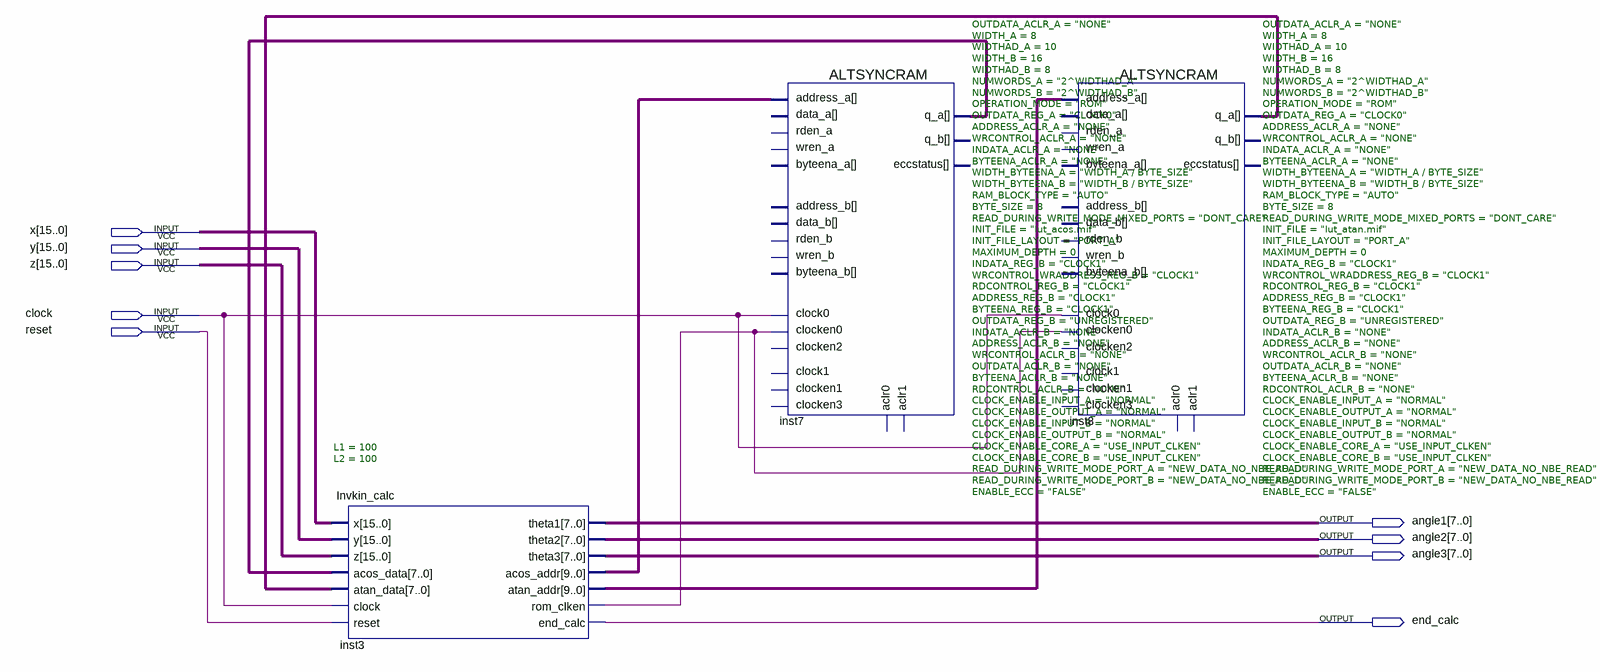
[diagram p0: schematic sheet]
// Quartus schematic invkin_geo.bdf as structural Verilog: 3 symbols, 9 pins
module invkin_geo (
  input  [15:0] x,
  input  [15:0] y,
  input  [15:0] z,
  input  clock,
  input  reset,
  output [7:0] angle1,
  output [7:0] angle2,
  output [7:0] angle3,
  output end_calc
);

  wire inst3_rom_clken;
  wire [7:0] inst7_q_a, inst8_q_a;
  wire [9:0] inst3_acos_addr, inst3_atan_addr;

  Invkin_calc #(.L1(100), .L2(100)) inst3 (
    .x(x), .y(y), .z(z), .acos_data(inst7_q_a), .atan_data(inst8_q_a), .clock(clock), .reset(reset),
    .theta1(angle1), .theta2(angle2), .theta3(angle3), .acos_addr(inst3_acos_addr),
    .atan_addr(inst3_atan_addr), .rom_clken(inst3_rom_clken), .end_calc(end_calc));
  ALTSYNCRAM #(.OUTDATA_ACLR_A("NONE"), .WIDTH_A(8), .WIDTHAD_A(10), .WIDTH_B(16), .WIDTHAD_B(8), .NUMWORDS_A("2^WIDTHAD_A"), .NUMWORDS_B("2^WIDTHAD_B"), .OPERATION_MODE("ROM"), .OUTDATA_REG_A("CLOCK0"), .ADDRESS_ACLR_A("NONE"), .WRCONTROL_ACLR_A("NONE"), .INDATA_ACLR_A("NONE"), .BYTEENA_ACLR_A("NONE"), .WIDTH_BYTEENA_A("WIDTH_A / BYTE_SIZE"), .WIDTH_BYTEENA_B("WIDTH_B / BYTE_SIZE"), .RAM_BLOCK_TYPE("AUTO"), .BYTE_SIZE(8), .READ_DURING_WRITE_MODE_MIXED_PORTS("DONT_CARE"), .INIT_FILE("lut_acos.mif"), .INIT_FILE_LAYOUT("PORT_A"), .MAXIMUM_DEPTH(0), .INDATA_REG_B("CLOCK1"), .WRCONTROL_WRADDRESS_REG_B("CLOCK1"), .RDCONTROL_REG_B("CLOCK1"), .ADDRESS_REG_B("CLOCK1"), .BYTEENA_REG_B("CLOCK1"), .OUTDATA_REG_B("UNREGISTERED"), .INDATA_ACLR_B("NONE"), .ADDRESS_ACLR_B("NONE"), .WRCONTROL_ACLR_B("NONE"), .OUTDATA_ACLR_B("NONE"), .BYTEENA_ACLR_B("NONE"), .RDCONTROL_ACLR_B("NONE"), .CLOCK_ENABLE_INPUT_A("NORMAL"), .CLOCK_ENABLE_OUTPUT_A("NORMAL"), .CLOCK_ENABLE_INPUT_B("NORMAL"), .CLOCK_ENABLE_OUTPUT_B("NORMAL"), .CLOCK_ENABLE_CORE_A("USE_INPUT_CLKEN"), .CLOCK_ENABLE_CORE_B("USE_INPUT_CLKEN"), .READ_DURING_WRITE_MODE_PORT_A("NEW_DATA_NO_NBE_READ"), .READ_DURING_WRITE_MODE_PORT_B("NEW_DATA_NO_NBE_READ"), .ENABLE_ECC("FALSE")) inst7 (
    .address_a(inst3_acos_addr), .clock0(clock), .clocken0(inst3_rom_clken), .q_a(inst7_q_a));  // open: wren_a, byteena_a, data_b, rden_b, wren_b, byteena_b, clock1, clocken1, aclr0, aclr1, data_a, address_b, clocken3, clocken2, rden_a, q_b, eccstatus
  ALTSYNCRAM #(.OUTDATA_ACLR_A("NONE"), .WIDTH_A(8), .WIDTHAD_A(10), .WIDTH_B(16), .WIDTHAD_B(8), .NUMWORDS_A("2^WIDTHAD_A"), .NUMWORDS_B("2^WIDTHAD_B"), .OPERATION_MODE("ROM"), .OUTDATA_REG_A("CLOCK0"), .ADDRESS_ACLR_A("NONE"), .WRCONTROL_ACLR_A("NONE"), .INDATA_ACLR_A("NONE"), .BYTEENA_ACLR_A("NONE"), .WIDTH_BYTEENA_A("WIDTH_A / BYTE_SIZE"), .WIDTH_BYTEENA_B("WIDTH_B / BYTE_SIZE"), .RAM_BLOCK_TYPE("AUTO"), .BYTE_SIZE(8), .READ_DURING_WRITE_MODE_MIXED_PORTS("DONT_CARE"), .INIT_FILE("lut_atan.mif"), .INIT_FILE_LAYOUT("PORT_A"), .MAXIMUM_DEPTH(0), .INDATA_REG_B("CLOCK1"), .WRCONTROL_WRADDRESS_REG_B("CLOCK1"), .RDCONTROL_REG_B("CLOCK1"), .ADDRESS_REG_B("CLOCK1"), .BYTEENA_REG_B("CLOCK1"), .OUTDATA_REG_B("UNREGISTERED"), .INDATA_ACLR_B("NONE"), .ADDRESS_ACLR_B("NONE"), .WRCONTROL_ACLR_B("NONE"), .OUTDATA_ACLR_B("NONE"), .BYTEENA_ACLR_B("NONE"), .RDCONTROL_ACLR_B("NONE"), .CLOCK_ENABLE_INPUT_A("NORMAL"), .CLOCK_ENABLE_OUTPUT_A("NORMAL"), .CLOCK_ENABLE_INPUT_B("NORMAL"), .CLOCK_ENABLE_OUTPUT_B("NORMAL"), .CLOCK_ENABLE_CORE_A("USE_INPUT_CLKEN"), .CLOCK_ENABLE_CORE_B("USE_INPUT_CLKEN"), .READ_DURING_WRITE_MODE_PORT_A("NEW_DATA_NO_NBE_READ"), .READ_DURING_WRITE_MODE_PORT_B("NEW_DATA_NO_NBE_READ"), .ENABLE_ECC("FALSE")) inst8 (
    .address_a(inst3_atan_addr), .clock0(clock), .clocken0(inst3_rom_clken), .q_a(inst8_q_a));  // open: wren_a, byteena_a, data_b, rden_b, wren_b, byteena_b, clock1, clocken1, aclr0, aclr1, data_a, address_b, clocken3, clocken2, rden_a, q_b, eccstatus
endmodule
